# Altium schematic sheet rtc.SchDoc
size Letter
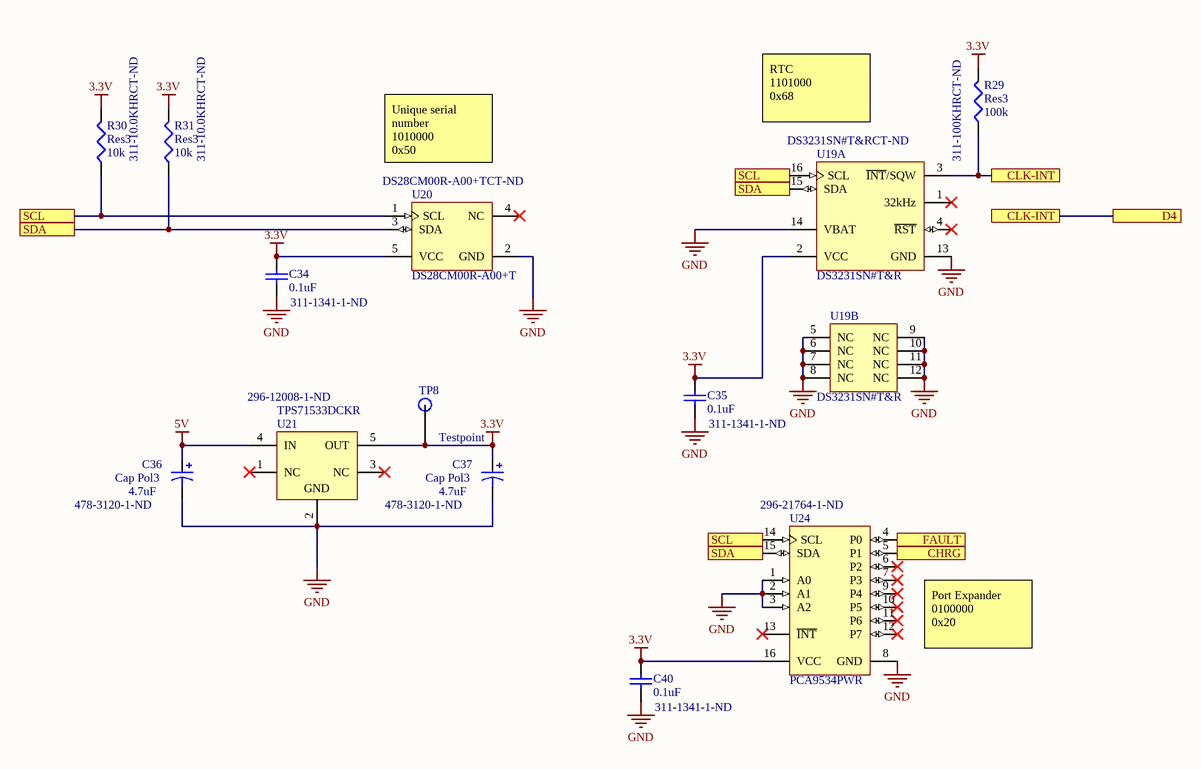
[diagram p0: rtc.SchDoc]

## Parts
C34  value 0.1uF  Supplier Part Number 1: 311-1341-1-ND  [1608[0603]]  (hidden comment: Cap Semi)
C35  value 0.1uF  Supplier Part Number 1: 311-1341-1-ND  [1608[0603]]  (hidden comment: Cap Semi)
C36  Cap Pol3  value 4.7uF  Supplier Part Number 1: 478-3120-1-ND  [1206-pol]
C37  Cap Pol3  value 4.7uF  Supplier Part Number 1: 478-3120-1-ND  [1206-pol]
C40  value 0.1uF  Supplier Part Number 1: 311-1341-1-ND  [1608[0603]]  (hidden comment: Cap Semi)
R29  Res3  value 100k  Supplier Part Number 1: 311-100KHRCT-ND  [J1-0603]
R30  Res3  value 10k  Supplier Part Number 1: 311-10.0KHRCT-ND  [J1-0603]
R31  Res3  value 10k  Supplier Part Number 1: 311-10.0KHRCT-ND  [J1-0603]
TP8  Testpoint  [testpoint]  (no BOM)
U19  DS3231SN#T&R  Supplier Part Number 1: DS3231SN#T&RCT-ND  [W16#H2_M]  (parts A,B of 2)
U20  DS28CM00R-A00+T  Supplier Part Number 1: DS28CM00R-A00+TCT-ND  [U5+1_M]
U21  TPS71533DCKR  Supplier Part Number 1: 296-12008-1-ND  [DCK0005A_L]
U24  PCA9534PWR  Supplier Part Number 1: 296-21764-1-ND  [PW0016A_N]

## Ports
CHRG, CLK-INT, D4, FAULT, SCL, SDA

## Nets
3.3V: C34.1 C35.1 C37.1 C40.1 R29.2 R30.2 R31.2 TP8.1 U19.2(VCC) U20.5(VCC) U21.5(OUT) U24.16(VCC)
5V: C36.1 U21.4(IN)
GND: C34.2 C35.2 C36.2 C37.2 C40.2 U19.5(NC) U19.6(NC) U19.7(NC) U19.8(NC) U19.9(NC) U19.10(NC) U19.11(NC) U19.12(NC) U19.13(GND) U19.14(VBAT) U20.2(GND) U21.2(GND) U24.1(A0) U24.2(A1) U24.3(A2) U24.8(GND)
CHRG: U24.5(P1) ; port CHRG
CLK-INT: R29.1 U19.3(~{INT}/SQW) ; port CLK-INT, port D4
FAULT: U24.4(P0) ; port FAULT
SCL: R30.1 U19.16(SCL) U20.1(SCL) U24.14(SCL) ; port SCL
SDA: R31.1 U19.15(SDA) U20.3(SDA) U24.15(SDA) ; port SDA

Not connected (* = marked no-connect by the designer): U19 1(32kHz)* 4(~{RST})*; U20 4(NC)*; U21 1(NC)* 3(NC)*; U24 6(P2)* 7(P3)* 9(P4)* 10(P5)* 11(P6)* 12(P7)* 13(~{INT})*

## Notes on the sheet
- Unique serial number
  1010000
  0x50
- RTC
  1101000
  0x68
- Port Expander
  0100000
  0x20

## Library data of the parts
C34 C35 C40 = Cap Semi: Capacitor (Semiconductor SIM Model); Manufacturer: Yageo; Manufacturer Part Number: CC0603KRX7R8BB104; Capacitance: 100nF; Tolerance: 10%; Voltage Rating: 25V; Dielectric: X7R; ComponentLink1URL: http://www.samsungsem.com/servlet/FileDownload?type=spec&file=CL10B104KB8NNNC.pdf; ComponentLink1Description: http://www.samsungsem.com/servlet/FileDownload?type=spec&file=CL10B104KB8NNNC.pdf; Supplier 1: Digi-Key; Stock 1: 22812167; Pricing 1: 1=0.10000, 10=0.05000, 100=0.02220, 500=0.01584, 1000=0.01245 (USD); RoHS: Yes; Mount: Surface Mount; Case/Package: 0603; Number of Pins: 2; Case Code (Imperial): 0603; Case Code (Metric): 1608; Min Operating Temperature: -55°C; Max Operating Temperature: 125°C; Packaging: Tape and Reel; Package Quantity: 1; Voltage Rating (DC): 25V; Termination: SMD/SMT; Composition: Ceramic; Voltage: 25V; Length: 1.6mm; Height: 0.8mm; Width: 0.8mm; Thickness: 0.035inch; Depth: 0.8mm; Radiation Hardening: No; REACH SVHC: Unknown; Lead Free: Lead Free; Halogen Free: Halogen Free; ComponentLink2URL: https://datasheet.ciiva.com/11786/0900766b80c10176-11786120.pdf?src-supplier=RSComponents; ComponentLink2Description: https://datasheet.ciiva.com/11786/0900766b80c10176-11786120.pdf?src-supplier=RSComponents; ComponentLink3URL: https://datasheet.ciiva.com/144/mlccorderingcode-144075.pdf?src-supplier=Digi-Key; ComponentLink3Description: https://datasheet.ciiva.com/144/mlccorderingcode-144075.pdf?src-supplier=Digi-Key; ComponentLink4URL: https://datasheet.ciiva.com/17434/upy-gphc-x7r-6-3v-to-50v-8-17434263.pdf?src-supplier=Avnet+Europe; ComponentLink4Description: https://datasheet.ciiva.com/17434/upy-gphc-x7r-6-3v-to-50v-8-17434263.pdf?src-supplier=Avnet+Europe; ComponentLink5URL: https://datasheet.ciiva.com/26829/getdatasheetpartid-403577-26829431.pdf?src-supplier=Verical; ComponentLink5Description: https://datasheet.ciiva.com/26829/getdatasheetpartid-403577-26829431.pdf?src-supplier=Verical; ComponentLink6URL: https://datasheet.ciiva.com/11587/upy-gphc-x7r-6-3v-to-50v-8-11587208.pdf?src-supplier=Avnet; ComponentLink6Description: https://datasheet.ciiva.com/11587/upy-gphc-x7r-6-3v-to-50v-8-11587208.pdf?src-supplier=Avnet; ComponentLink7URL: https://datasheet.ciiva.com/13389/upy-gphc-x7r-6-3v-to-50v-8-13389352.pdf?src-supplier=Mouser; ComponentLink7Description: https://datasheet.ciiva.com/13389/upy-gphc-x7r-6-3v-to-50v-8-13389352.pdf?src-supplier=Mouser; ComponentLink8URL: https://datasheet.ciiva.com/28450/1489800-28450584.pdf?src-supplier=Element14; ComponentLink8Description: https://datasheet.ciiva.com/28450/1489800-28450584.pdf?src-supplier=Element14; ComponentLink9URL: https://datasheet.ciiva.com/144/mlccorderingcode-144073.pdf?src-supplier=Digi-Key; ComponentLink9Description: https://datasheet.ciiva.com/144/mlccorderingcode-144073.pdf?src-supplier=Digi-Key; ComponentLink10URL: https://datasheet.ciiva.com/144/mlccorderingcode-144074.pdf?src-supplier=Digi-Key; ComponentLink10Description: https://datasheet.ciiva.com/144/mlccorderingcode-144074.pdf?src-supplier=Digi-Key; ComponentLink11URL: https://datasheet.ciiva.com/7978/1489800-7978155.pdf?src-supplier=Element14; ComponentLink11Description: https://datasheet.ciiva.com/7978/1489800-7978155.pdf?src-supplier=Element14
C36 C37 = Cap Pol3: Polarized Capacitor (Surface Mount); Manufacturer: AVX Corporation; Manufacturer Part Number: NOJA475M010RWJ; Manufacturer Size Code: A; Tolerance: ±20%; Dissipation Factor: 6%; Supplier 1: Digi-Key; RoHS: RoHS Compliant; Category: Capacitors; Stock 1: 5356; Pricing 1: 1=0.68, 10=0.485, 100=0.319, 500=0.2363, 1000=0.20086 (CAD); Packaging: Cut Tape (CT); Part Status: Active; Mounting Type: Surface Mount; Package / Case: 1206 (3216 Metric); Height - Seated (Max): 0.071" (1.80mm); Features: -; Operating Temperature: -55°C ~ 105°C; Supplier Device Package: 1206 (3216 Metric); Size / Dimension: 0.126" L x 0.063" W (3.20mm x 1.60mm); ComponentLink1URL: http://datasheets.avx.com/NOJ.pdf; ComponentLink1Description: http://datasheets.avx.com/NOJ.pdf
R29 = Res3: Resistor; Manufacturer: Yageo; Manufacturer Part Number: RC0603FR-07100KL; Tolerance: ±1%; Power (Watts): 0.1W, 1/10W; Temperature Coefficient: ±100ppm/°C; Published: 8-Jun-2000; LatestRevisionDate: 29-May-2009; LatestRevisionNote: IPC-7351 Footprint Added.; PackageReference: J1-0603; Publisher: Altium Limited; PackageDescription: Chip Resistor; Supplier 1: Digi-Key; RoHS: RoHS Compliant; Category: Resistors; Stock 1: 8279421; Pricing 1: 1=0.14, 10=0.021, 100=0.0086, 1000=0.00383, 2500=0.00333 (CAD); Packaging: Cut Tape (CT); Part Status: Active; Composition: Thick Film; Features: Moisture Resistant; Operating Temperature: -55°C ~ 155°C; Package / Case: 0603 (1608 Metric); Supplier Device Package: 0603; Size / Dimension: 0.063" L x 0.032" W (1.60mm x 0.80mm); Height - Seated (Max): 0.022" (0.55mm); Failure Rate: -; ComponentLink1URL: http://www.yageo.com/documents/recent/PYu-RC_Group_51_RoHS_L_7.pdf; ComponentLink1Description: http://www.yageo.com/documents/recent/PYu-RC_Group_51_RoHS_L_7.pdf
R30 R31 = Res3: Resistor; Manufacturer: Yageo; Manufacturer Part Number: RC0603FR-0710KL; Tolerance: 1%; Resistance: 10kR; Temperature Coefficient: 100ppm/°C; Voltage Rating (DC): 50V; Power Rating: 100mW; Voltage Rating: 75V; Published: 8-Jun-2000; LatestRevisionDate: 29-May-2009; LatestRevisionNote: IPC-7351 Footprint Added.; PackageReference: J1-0603; Publisher: Altium Limited; PackageDescription: Chip Resistor; Supplier 1: Digi-Key; Stock 1: 90146690; Pricing 1: 1 = 0.10000, 10 = 0.02400, 100 = 0.00970, 1000 = 0.00437, 2500 = 0.00379 (USD); RoHS: Yes; Case/Package: 0603; Number of Pins: 2; Weight: 7.1E-05oz; Case Code (Imperial): 0603; Case Code (Metric): 1608; Min Operating Temperature: -55°C; Max Operating Temperature: 155°C; Composition: Thick Film; Packaging: Tape and Reel; Military Standard: Not; Termination: SMD/SMT; Length: 1.6mm; Height: 0.45mm; Width: 0.8mm; Depth: 0.8mm; Lead Pitch: 0.3mm; REACH SVHC: No SVHC; Lead Free: Lead Free; ComponentLink1URL: https://datasheet.ciiva.com/7660/38590-7660789.pdf?src-supplier=Element14; ComponentLink1Description: https://datasheet.ciiva.com/7660/38590-7660789.pdf?src-supplier=Element14; ComponentLink2URL: https://datasheet.ciiva.com/15189/getdatasheetpartid-409289-15189591.pdf?src-supplier=Verical; ComponentLink2Description: https://datasheet.ciiva.com/15189/getdatasheetpartid-409289-15189591.pdf?src-supplier=Verical; ComponentLink3URL: https://datasheet.ciiva.com/46440/1868787-46440891.pdf?src-supplier=Element14; ComponentLink3Description: https://datasheet.ciiva.com/46440/1868787-46440891.pdf?src-supplier=Element14; ComponentLink4URL: https://datasheet.ciiva.com/7983/443971-7983596.pdf?src-supplier=Element14; ComponentLink4Description: https://datasheet.ciiva.com/7983/443971-7983596.pdf?src-supplier=Element14; ComponentLink5URL: https://datasheet.ciiva.com/7746/1738695-7746239.pdf?src-supplier=Element14; ComponentLink5Description: https://datasheet.ciiva.com/7746/1738695-7746239.pdf?src-supplier=Element14; ComponentLink6URL: https://datasheet.ciiva.com/22747/443971-22747519.pdf?src-supplier=Element14; ComponentLink6Description: https://datasheet.ciiva.com/22747/443971-22747519.pdf?src-supplier=Element14
TP8 = SMT Testpoint
U19 = CMP-0254-00375-1: Extremely Accurate I2C-Integrated Real-Time Clock/TCXO/Crystal, 16-Pin SO, -40 to 85 degC, RoHS Qualified, Reel; Manufacturer: Maxim; Max Supply Voltage: 5.5V; Min Supply Voltage: 2.3V; Interface: I2C; Logic Function: Clock; Time Format: HH:MM:SS; Date Format: YY-MM-DD-dd; Operating Supply Voltage: 3.3V; DatasheetVersion: Rev 8, Jul-2010; ComponentLink2Description: Datasheet; ComponentLink3Description: Package Specification; Code_JEDEC: MS-013-AA; ComponentLink1URL: http://www.maxim-ic.com; PackageDescription: 16-Pin Small-Outline IC, Wide (0.3in), 1.27 mm Pitch, SOIC (W), RoHS Qualified; ComponentLink3URL: http://pdfserv.maxim-ic.com/package_dwgs/21-0042.PDF; Code_IPC: SOIC127P1030-16; PackageReference: W16#H2; PackageVersion: revD, 2010; ComponentLink1Description: Manufacturer URL; ComponentLink2URL: http://datasheets.maxim-ic.com/en/ds/DS3231.pdf; Supplier 1: Digi-Key; Manufacturer Part Number: DS3231SN#T&R; Stock 1: 3292; Pricing 1: 1=9.05000, 10=8.17200, 25=7.79160, 100=6.76520, 250=6.46120, 500=5.89108 (USD); RoHS: Yes; Mount: Surface Mount; Case/Package: SOIC; Number of Pins: 16; Contact Plating: Tin; Min Operating Temperature: -40°C; Max Operating Temperature: 85°C; Packaging: Tape and Reel; Package Quantity: 1000; Radiation Hardening: No; Lead Free: Lead Free; ComponentLink4URL: https://datasheet.ciiva.com/17307/ds3231-17307128.pdf?src-supplier=Avnet+Europe; ComponentLink4Description: https://datasheet.ciiva.com/17307/ds3231-17307128.pdf?src-supplier=Avnet+Europe; ComponentLink5URL: https://datasheet.ciiva.com/12291/ds3231-102175-12291260.pdf?src-supplier=Mouser; ComponentLink5Description: https://datasheet.ciiva.com/12291/ds3231-102175-12291260.pdf?src-supplier=Mouser; ComponentLink6URL: https://datasheet.ciiva.com/14244/ds3231-14244637.pdf?src-supplier=Avnet; ComponentLink6Description: https://datasheet.ciiva.com/14244/ds3231-14244637.pdf?src-supplier=Avnet; ComponentLink7URL: https://datasheet.ciiva.com/14244/ds3231-14244733.pdf?src-supplier=Avnet; ComponentLink7Description: https://datasheet.ciiva.com/14244/ds3231-14244733.pdf?src-supplier=Avnet
U20 = CMP-0219-00326-1: I²C/SMBus Silicon Serial Number, 5-pin SOT23, -40° to + 85° C, Pb-Free, Tape and Reel; Manufacturer: Maxim; Max Supply Voltage: 5.25V; Min Supply Voltage: 1.62V; DatasheetVersion: Nov-2006; PackageReference: U5+1; Code_JEDEC: MO-178AA; PackageVersion: revF, 2006; PackageDescription: 5-Pin Small-Outline Transistor Package, 0.95 mm Pitch, 2.8 mm Lead Span, SOT-23, Pb-Free; Supplier 1: Digi-Key; Manufacturer Part Number: DS28CM00R-A00+T; RoHS: Yes; Stock 1: 17327; Pricing 1: 1 = 1.67000, 10 = 1.50400, 25 = 1.41880, 100 = 1.20880, 250 = 1.13508, 500 = 0.99318, 1000 = 0.82292 (USD); Mount: Surface Mount; Case/Package: SOT-23-5; Number of Pins: 5; Min Operating Temperature: -40°C; Max Operating Temperature: 85°C; Packaging: Tape and Reel; Package Quantity: 1; Length: 3mm; Height: 1.3mm; Width: 1.75mm; Radiation Hardening: No; REACH SVHC: Unknown; Lead Free: Lead Free; ComponentLink1URL: https://datasheets.maximintegrated.com/en/ds/DS28CM00.pdf; ComponentLink1Description: https://datasheets.maximintegrated.com/en/ds/DS28CM00.pdf; ComponentLink2URL: http://datasheets.maximintegrated.com/en/ds/DS28CM00.pdf; ComponentLink2Description: http://datasheets.maximintegrated.com/en/ds/DS28CM00.pdf; ComponentLink3URL: http://www.mouser.com/ds/2/256/DS28CM00-102134.pdf; ComponentLink3Description: http://www.mouser.com/ds/2/256/DS28CM00-102134.pdf
U21 = CMP-0394-00925-2: Single Output LDO, 50 mA, Fixed 3.3 V Output, 3 to 24 V Input, 5-pin SC70 (DCK), -40 to 85 degC, Green (RoHS & no Sb/Br); Manufacturer: Texas Instruments; Accuracy(%): 4; Vdo(Typ)(mV): 415; Vin(Min)(V): 3; Iq(Typ)(mA): 0.003; Fixed Output Options(V): 3.3; SubFamily: Single Channel LDO; Iout(Max)(A): 0.05; Vin(Max)(V): 24; Dropout Voltage: 415mV; Output Current: 50mA; Number of Outputs: 1; Output Voltage: 3.3V; Max Power Dissipation: 320mW; Max Input Voltage: 24V; Min Input Voltage: 3V; Min Current Limit: 125mA; Input Bias Current: 3.2uA; Polarity: Positive; Quiescent Current: 3uA; Accuracy: 4%; Min Supply Voltage: 2.5V; ComponentLink3Description: Package Specification; ComponentLink1URL: http://www.ti.com/; ComponentLink3URL: http://www.ti.com/litv/pdf/mpds025f; PackageDescription: 5-Pin Plastic Small-Outline, Body 2 x 1.25 mm, Pitch 0.65 mm; PartNumber: TPS71533DCKR; Vout Adj(Min)(V): 3.3; ComponentLink2URL: http://www.ti.com/general/docs/lit/getliterature.tsp?genericPartNumber=TPS71533&fileType=pdf; ComponentLink2Description: Datasheet; ComponentLink1Description: Manufacturer URL; Code_JEDEC: MO-203; Vout Adj(Max)(V): 3.3; Mounting Technology: Surface Mount; DatasheetVersion: SLVS338P; Eco-Plan: Green (RoHS & no Sb/Br); PackageVersion: 4093553-3/G; PackageReference: DCK0005A; Supplier 1: Digi-Key; Manufacturer Part Number: TPS71533DCKR; Stock 1: 159612; Pricing 1: 1 = 0.90000, 10 = 0.80200, 100 = 0.62540, 500 = 0.51664, 1000 = 0.40788 (USD); RoHS: Yes; Case/Package: SC; Number of Pins: 5; Min Operating Temperature: -40°C; Max Operating Temperature: 125°C; Package Quantity: 3000; Packaging: Tape and Reel; Power Rating: 320mW; Max Output Current: 50mA; Number of Regulators: 1; Min Output Voltage: 3.3V; Power Dissipation: 320mW; Output Voltage Accuracy: 4%; Max Output Voltage: 3.3V; Output Type: Fixed; Nominal Output Voltage: 3.3V; Termination: SMD/SMT; Current Rating: 50mA; Length: 2mm; Height: 0.9mm; Width: 1.25mm; Radiation Hardening: No; Lead Free: Lead Free; REACH SVHC: No SVHC; ComponentLink4URL: https://datasheet.ciiva.com/22700/1835023-22700176.pdf?src-supplier=Element14; ComponentLink4Description: https://datasheet.ciiva.com/22700/1835023-22700176.pdf?src-supplier=Element14; ComponentLink5URL: https://datasheet.ciiva.com/27051/1116751-27051464.pdf?src-supplier=Jameco; ComponentLink5Description: https://datasheet.ciiva.com/27051/1116751-27051464.pdf?src-supplier=Jameco; ComponentLink6URL: https://datasheet.ciiva.com/7992/1854688-7992972.pdf?src-supplier=Element14; ComponentLink6Description: https://datasheet.ciiva.com/7992/1854688-7992972.pdf?src-supplier=Element14
U24 = CMP-0314-00331-2: Remote 8-Bit I2C and Low-Power I/O Expander with Interrupt Output and Configuration Register, 2.3 to 5.5 V, -40 to 85 degC, 16-pin TSSOP (PW), Green (RoHS & no Sb/Br); Manufacturer: Texas Instruments; SubFamily: I2C IO Expander; # of I/Os: 8; Configuration Registers: Yes; Max Frequency(kHz): 400; fSCLK(Max)(MHz): 0.1, 0.4; VCC(Min)(V): 2.3; I2C Address: 0100 xxx; VCC(Max)(V): 5.5; Frequency: 400kHz; Operating Supply Voltage: 5.5V; Code_JEDEC: MO-153; Push-Pull I/O Type: Yes; ComponentLink1URL: http://www.ti.com/general/docs/lit/getliterature.tsp?genericPartNumber=PCA9534&fileType=pdf; Interrupt Output: Yes; PartNumber: PCA9534PWR; Eco-Plan: Green (RoHS & no Sb/Br); No. of Outputs: 8; 5V Tolerant I/O: Yes; PackageDescription: 16-Pin Plastic Thin Small Outline Package 5 x 4.4 mm Body ,0.65 mm Pitch; Vcc range(V): 2.3 to 5.5; ComponentLink1Description: Datasheet; PackageReference: PW0016A; Mounting Technology: Surface Mount; PackageVersion: revG, Feb-2011; DatasheetVersion: SCPS124F; Low Power: Yes; Supplier 1: Digi-Key; Manufacturer Part Number: PCA9534PWR; Stock 1: 48653; Pricing 1: 1=1.74000, 10=1.56100, 100=1.25490, 500=1.03104, 1000=0.85428 (USD); RoHS: Yes; Case/Package: TSSOP; Number of Pins: 16; Weight: 0.002183oz; Min Operating Temperature: -40°C; Max Operating Temperature: 85°C; Packaging: Tape and Reel; Package Quantity: 1; Number of Outputs: 8; Number of I/Os: 8; Max Frequency: 400kHz; Radiation Hardening: No; Lead Free: Lead Free; ComponentLink3URL: https://datasheet.ciiva.com/15134/getdatasheetpartid-253001-15134573.pdf?src-supplier=Verical; ComponentLink3Description: https://datasheet.ciiva.com/15134/getdatasheetpartid-253001-15134573.pdf?src-supplier=Verical; ComponentLink4URL: https://datasheet.ciiva.com/1780/pca9534-1780321.pdf?src-supplier=Digi-Key; ComponentLink4Description: https://datasheet.ciiva.com/1780/pca9534-1780321.pdf?src-supplier=Digi-Key; ComponentLink5URL: https://datasheet.ciiva.com/1780/pca9534-1780322.pdf?src-supplier=Digi-Key; ComponentLink5Description: https://datasheet.ciiva.com/1780/pca9534-1780322.pdf?src-supplier=Digi-Key; ComponentLink6URL: https://datasheet.ciiva.com/1780/pca9534-1780323.pdf?src-supplier=Digi-Key; ComponentLink6Description: https://datasheet.ciiva.com/1780/pca9534-1780323.pdf?src-supplier=Digi-Key; ComponentLink7URL: https://datasheet.ciiva.com/3149/pca9534-3149291.pdf?src-supplier=Avnet; ComponentLink7Description: https://datasheet.ciiva.com/3149/pca9534-3149291.pdf?src-supplier=Avnet